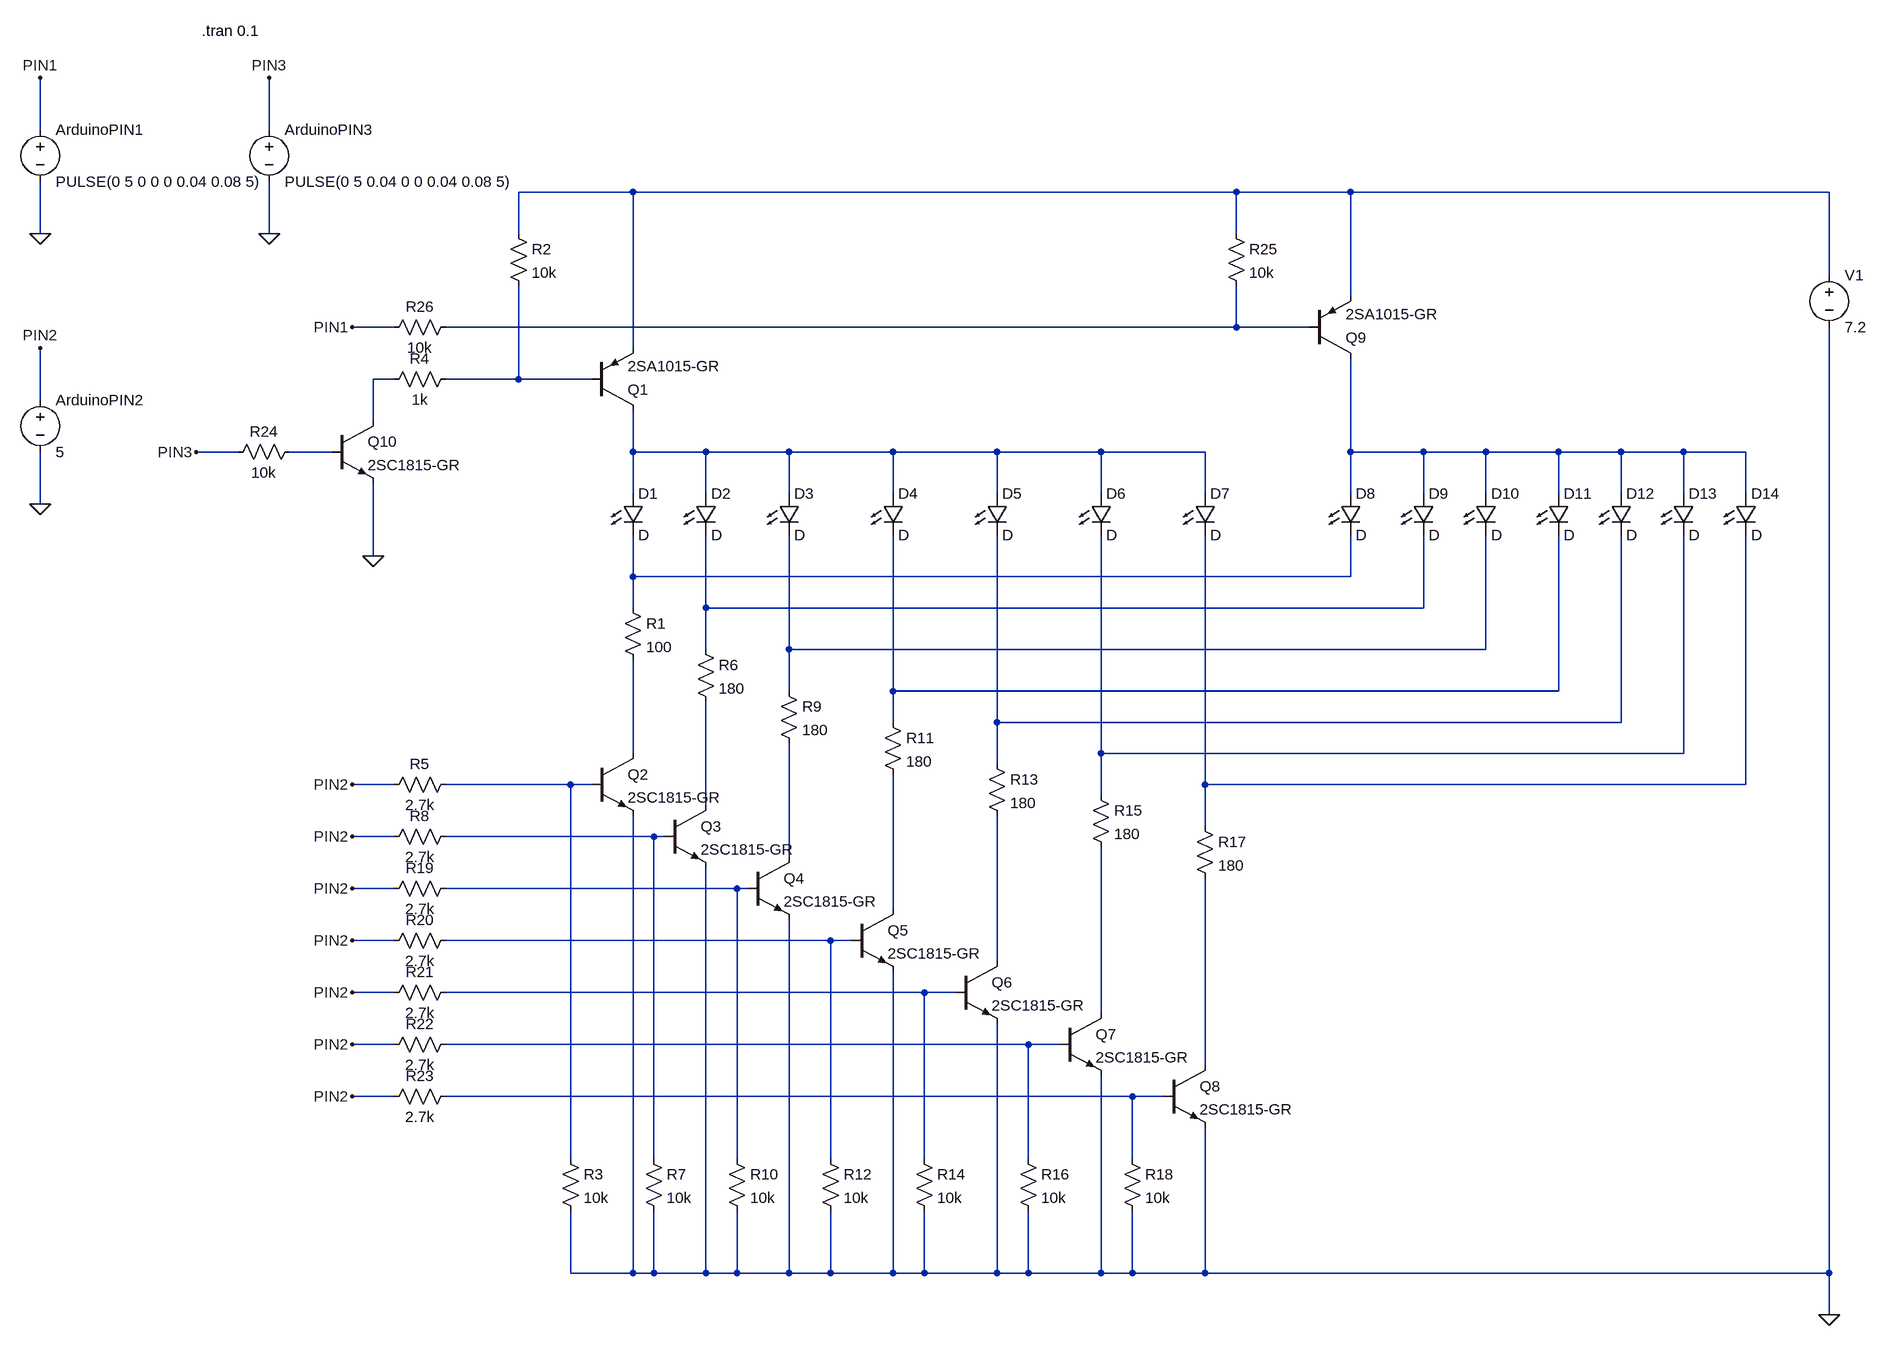
[diagram p0: schematic LEDdrive_Gerbera_altimeter.asc]
LEDdrive_Gerbera_altimeter.asc, the LTspice schematic file:
Version 4
SHEET 1 3472 2500
WIRE -720 0 -720 -80
WIRE -368 0 -368 -80
WIRE 192 96 16 96
WIRE 1120 96 192 96
WIRE 1296 96 1120 96
WIRE 2032 96 1296 96
WIRE -720 160 -720 80
WIRE -368 160 -368 80
WIRE 16 160 16 96
WIRE 1120 160 1120 96
WIRE 2032 224 2032 96
WIRE 1296 256 1296 96
WIRE -176 304 -240 304
WIRE 1120 304 1120 240
WIRE 1120 304 -96 304
WIRE 1232 304 1120 304
WIRE 192 336 192 96
WIRE -176 384 -208 384
WIRE 16 384 16 240
WIRE 16 384 -96 384
WIRE 128 384 16 384
WIRE -720 416 -720 336
WIRE -208 448 -208 384
WIRE -416 496 -480 496
WIRE -272 496 -336 496
WIRE 192 496 192 432
WIRE 304 496 192 496
WIRE 432 496 304 496
WIRE 592 496 432 496
WIRE 752 496 592 496
WIRE 912 496 752 496
WIRE 1072 496 912 496
WIRE 1296 496 1296 352
WIRE 1408 496 1296 496
WIRE 1504 496 1408 496
WIRE 1616 496 1504 496
WIRE 1712 496 1616 496
WIRE 1808 496 1712 496
WIRE 1904 496 1808 496
WIRE 192 560 192 496
WIRE 304 560 304 496
WIRE 432 560 432 496
WIRE 592 560 592 496
WIRE 752 560 752 496
WIRE 912 560 912 496
WIRE 1072 560 1072 496
WIRE 1296 560 1296 496
WIRE 1408 560 1408 496
WIRE 1504 560 1504 496
WIRE 1616 560 1616 496
WIRE 1712 560 1712 496
WIRE 1808 560 1808 496
WIRE 1904 560 1904 496
WIRE -720 576 -720 496
WIRE -208 656 -208 544
WIRE 192 688 192 624
WIRE 1296 688 1296 624
WIRE 1296 688 192 688
WIRE 192 736 192 688
WIRE 304 736 304 624
WIRE 1408 736 1408 624
WIRE 1408 736 304 736
WIRE 304 800 304 736
WIRE 432 800 432 624
WIRE 1504 800 1504 624
WIRE 1504 800 432 800
WIRE 432 864 432 800
WIRE 592 864 592 624
WIRE 1616 864 1616 624
WIRE 1616 864 592 864
WIRE 592 912 592 864
WIRE 752 912 752 624
WIRE 1712 912 1712 624
WIRE 1712 912 752 912
WIRE 192 960 192 816
WIRE 912 960 912 624
WIRE 1808 960 1808 624
WIRE 1808 960 912 960
WIRE 752 976 752 912
WIRE -176 1008 -240 1008
WIRE 96 1008 -96 1008
WIRE 128 1008 96 1008
WIRE 1072 1008 1072 624
WIRE 1904 1008 1904 624
WIRE 1904 1008 1072 1008
WIRE 912 1024 912 960
WIRE 304 1040 304 880
WIRE 1072 1072 1072 1008
WIRE -176 1088 -240 1088
WIRE 224 1088 -96 1088
WIRE 240 1088 224 1088
WIRE 432 1120 432 944
WIRE -176 1168 -240 1168
WIRE 352 1168 -96 1168
WIRE 368 1168 352 1168
WIRE 592 1200 592 992
WIRE -176 1248 -240 1248
WIRE 496 1248 -96 1248
WIRE 528 1248 496 1248
WIRE 752 1280 752 1056
WIRE -176 1328 -240 1328
WIRE 640 1328 -96 1328
WIRE 688 1328 640 1328
WIRE 912 1360 912 1104
WIRE -176 1408 -240 1408
WIRE 800 1408 -96 1408
WIRE 848 1408 800 1408
WIRE 1072 1440 1072 1152
WIRE -176 1488 -240 1488
WIRE 960 1488 -96 1488
WIRE 1008 1488 960 1488
WIRE 96 1584 96 1008
WIRE 224 1584 224 1088
WIRE 352 1584 352 1168
WIRE 496 1584 496 1248
WIRE 640 1584 640 1328
WIRE 800 1584 800 1408
WIRE 960 1584 960 1488
WIRE 96 1760 96 1664
WIRE 192 1760 192 1056
WIRE 192 1760 96 1760
WIRE 224 1760 224 1664
WIRE 224 1760 192 1760
WIRE 304 1760 304 1136
WIRE 304 1760 224 1760
WIRE 352 1760 352 1664
WIRE 352 1760 304 1760
WIRE 432 1760 432 1216
WIRE 432 1760 352 1760
WIRE 496 1760 496 1664
WIRE 496 1760 432 1760
WIRE 592 1760 592 1296
WIRE 592 1760 496 1760
WIRE 640 1760 640 1664
WIRE 640 1760 592 1760
WIRE 752 1760 752 1376
WIRE 752 1760 640 1760
WIRE 800 1760 800 1664
WIRE 800 1760 752 1760
WIRE 912 1760 912 1456
WIRE 912 1760 800 1760
WIRE 960 1760 960 1664
WIRE 960 1760 912 1760
WIRE 1072 1760 1072 1536
WIRE 1072 1760 960 1760
WIRE 2032 1760 2032 304
WIRE 2032 1760 1072 1760
WIRE 2032 1824 2032 1760
FLAG -720 160 0
FLAG -720 -80 PIN1
FLAG -240 1008 PIN2
FLAG -720 576 0
FLAG -720 336 PIN2
FLAG -240 1088 PIN2
FLAG -240 1168 PIN2
FLAG -240 1248 PIN2
FLAG -240 1328 PIN2
FLAG -240 1408 PIN2
FLAG -240 1488 PIN2
FLAG -240 304 PIN1
FLAG 2032 1824 0
FLAG -368 160 0
FLAG -368 -80 PIN3
FLAG -208 656 0
FLAG -480 496 PIN3
SYMBOL pnp 128 432 M180
SYMATTR InstName Q1
SYMATTR Value 2SA1015-GR
SYMBOL npn 128 960 R0
SYMATTR InstName Q2
SYMATTR Value 2SC1815-GR
SYMBOL res 176 720 R0
SYMATTR InstName R1
SYMATTR Value 100
SYMBOL LED 176 560 R0
SYMATTR InstName D1
SYMBOL res 0 144 R0
SYMATTR InstName R2
SYMATTR Value 10k
SYMBOL res 80 1568 R0
SYMATTR InstName R3
SYMATTR Value 10k
SYMBOL res -80 368 R90
WINDOW 0 0 56 VBottom 2
WINDOW 3 32 56 VTop 2
SYMATTR InstName R4
SYMATTR Value 1k
SYMBOL res -80 992 R90
WINDOW 0 0 56 VBottom 2
WINDOW 3 32 56 VTop 2
SYMATTR InstName R5
SYMATTR Value 2.7k
SYMBOL voltage 2032 208 R0
WINDOW 123 0 0 Left 2
WINDOW 39 0 0 Left 2
SYMATTR InstName V1
SYMATTR Value 7.2
SYMBOL voltage -720 -16 R0
WINDOW 123 0 0 Left 2
WINDOW 39 0 0 Left 2
SYMATTR InstName ArduinoPIN1
SYMATTR Value PULSE(0 5 0 0 0 0.04 0.08 5)
SYMBOL voltage -720 400 R0
WINDOW 123 0 0 Left 2
WINDOW 39 0 0 Left 2
SYMATTR InstName ArduinoPIN2
SYMATTR Value 5
SYMBOL npn 240 1040 R0
SYMATTR InstName Q3
SYMATTR Value 2SC1815-GR
SYMBOL res 288 784 R0
SYMATTR InstName R6
SYMATTR Value 180
SYMBOL LED 288 560 R0
SYMATTR InstName D2
SYMBOL res 208 1568 R0
SYMATTR InstName R7
SYMATTR Value 10k
SYMBOL res -80 1072 R90
WINDOW 0 0 56 VBottom 2
WINDOW 3 32 56 VTop 2
SYMATTR InstName R8
SYMATTR Value 2.7k
SYMBOL npn 368 1120 R0
SYMATTR InstName Q4
SYMATTR Value 2SC1815-GR
SYMBOL res 416 848 R0
SYMATTR InstName R9
SYMATTR Value 180
SYMBOL LED 416 560 R0
SYMATTR InstName D3
SYMBOL res 336 1568 R0
SYMATTR InstName R10
SYMATTR Value 10k
SYMBOL npn 528 1200 R0
SYMATTR InstName Q5
SYMATTR Value 2SC1815-GR
SYMBOL res 576 896 R0
SYMATTR InstName R11
SYMATTR Value 180
SYMBOL LED 576 560 R0
SYMATTR InstName D4
SYMBOL res 480 1568 R0
SYMATTR InstName R12
SYMATTR Value 10k
SYMBOL npn 688 1280 R0
SYMATTR InstName Q6
SYMATTR Value 2SC1815-GR
SYMBOL res 736 960 R0
SYMATTR InstName R13
SYMATTR Value 180
SYMBOL LED 736 560 R0
SYMATTR InstName D5
SYMBOL res 624 1568 R0
SYMATTR InstName R14
SYMATTR Value 10k
SYMBOL npn 848 1360 R0
SYMATTR InstName Q7
SYMATTR Value 2SC1815-GR
SYMBOL res 896 1008 R0
SYMATTR InstName R15
SYMATTR Value 180
SYMBOL LED 896 560 R0
SYMATTR InstName D6
SYMBOL res 784 1568 R0
SYMATTR InstName R16
SYMATTR Value 10k
SYMBOL npn 1008 1440 R0
SYMATTR InstName Q8
SYMATTR Value 2SC1815-GR
SYMBOL res 1056 1056 R0
SYMATTR InstName R17
SYMATTR Value 180
SYMBOL LED 1056 560 R0
SYMATTR InstName D7
SYMBOL res 944 1568 R0
SYMATTR InstName R18
SYMATTR Value 10k
SYMBOL res -80 1152 R90
WINDOW 0 0 56 VBottom 2
WINDOW 3 32 56 VTop 2
SYMATTR InstName R19
SYMATTR Value 2.7k
SYMBOL res -80 1232 R90
WINDOW 0 0 56 VBottom 2
WINDOW 3 32 56 VTop 2
SYMATTR InstName R20
SYMATTR Value 2.7k
SYMBOL res -80 1312 R90
WINDOW 0 0 56 VBottom 2
WINDOW 3 32 56 VTop 2
SYMATTR InstName R21
SYMATTR Value 2.7k
SYMBOL res -80 1392 R90
WINDOW 0 0 56 VBottom 2
WINDOW 3 32 56 VTop 2
SYMATTR InstName R22
SYMATTR Value 2.7k
SYMBOL res -80 1472 R90
WINDOW 0 0 56 VBottom 2
WINDOW 3 32 56 VTop 2
SYMATTR InstName R23
SYMATTR Value 2.7k
SYMBOL pnp 1232 352 M180
SYMATTR InstName Q9
SYMATTR Value 2SA1015-GR
SYMBOL LED 1280 560 R0
SYMATTR InstName D8
SYMBOL res 1104 144 R0
SYMATTR InstName R25
SYMATTR Value 10k
SYMBOL res -80 288 R90
WINDOW 0 0 56 VBottom 2
WINDOW 3 32 56 VTop 2
SYMATTR InstName R26
SYMATTR Value 10k
SYMBOL LED 1392 560 R0
SYMATTR InstName D9
SYMBOL LED 1488 560 R0
SYMATTR InstName D10
SYMBOL LED 1600 560 R0
SYMATTR InstName D11
SYMBOL LED 1696 560 R0
SYMATTR InstName D12
SYMBOL LED 1792 560 R0
SYMATTR InstName D13
SYMBOL LED 1888 560 R0
SYMATTR InstName D14
SYMBOL voltage -368 -16 R0
WINDOW 123 0 0 Left 2
WINDOW 39 0 0 Left 2
SYMATTR InstName ArduinoPIN3
SYMATTR Value PULSE(0 5 0.04 0 0 0.04 0.08 5)
SYMBOL npn -272 448 R0
SYMATTR InstName Q10
SYMATTR Value 2SC1815-GR
SYMBOL res -320 480 R90
WINDOW 0 0 56 VBottom 2
WINDOW 3 32 56 VTop 2
SYMATTR InstName R24
SYMATTR Value 10k
TEXT -472 -152 Left 2 !.tran 0.1

The netlist it stands for:
* LEDdrive_Gerbera_altimeter.asc
Q1 N006 N004 N001 0 2SA1015-GR
Q2 N013 N015 0 0 2SC1815-GR
R1 N008 N013 100
D1 N006 N008 D
R2 N001 N004 10k
R3 N015 0 10k
R4 N004 N003 1k
R5 N015 PIN2 2.7k
V1 N001 0 7.2
V§ArduinoPIN1 PIN1 0 PULSE(0 5 0 0 0 0.04 0.08 5)
V§ArduinoPIN2 PIN2 0 5
Q3 N017 N018 0 0 2SC1815-GR
R6 N009 N017 180
D2 N006 N009 D
R7 N018 0 10k
R8 N018 PIN2 2.7k
Q4 N019 N020 0 0 2SC1815-GR
R9 N010 N019 180
D3 N006 N010 D
R10 N020 0 10k
Q5 N021 N022 0 0 2SC1815-GR
R11 N011 N021 180
D4 N006 N011 D
R12 N022 0 10k
Q6 N023 N024 0 0 2SC1815-GR
R13 N012 N023 180
D5 N006 N012 D
R14 N024 0 10k
Q7 N025 N026 0 0 2SC1815-GR
R15 N014 N025 180
D6 N006 N014 D
R16 N026 0 10k
Q8 N027 N028 0 0 2SC1815-GR
R17 N016 N027 180
D7 N006 N016 D
R18 N028 0 10k
R19 N020 PIN2 2.7k
R20 N022 PIN2 2.7k
R21 N024 PIN2 2.7k
R22 N026 PIN2 2.7k
R23 N028 PIN2 2.7k
Q9 N007 N002 N001 0 2SA1015-GR
D8 N007 N008 D
R25 N001 N002 10k
R26 N002 PIN1 10k
D9 N007 N009 D
D10 N007 N010 D
D11 N007 N011 D
D12 N007 N012 D
D13 N007 N014 D
D14 N007 N016 D
V§ArduinoPIN3 PIN3 0 PULSE(0 5 0.04 0 0 0.04 0.08 5)
Q10 N003 N005 0 0 2SC1815-GR
R24 N005 PIN3 10k
.model D D
.lib standard.dio
.model NPN NPN
.model PNP PNP
.lib standard.bjt
.tran 0.1
.backanno
.end